# Altium schematic sheet mcu_core.SchDoc
size A4; SheetNumber: 3; SheetTotal: 12
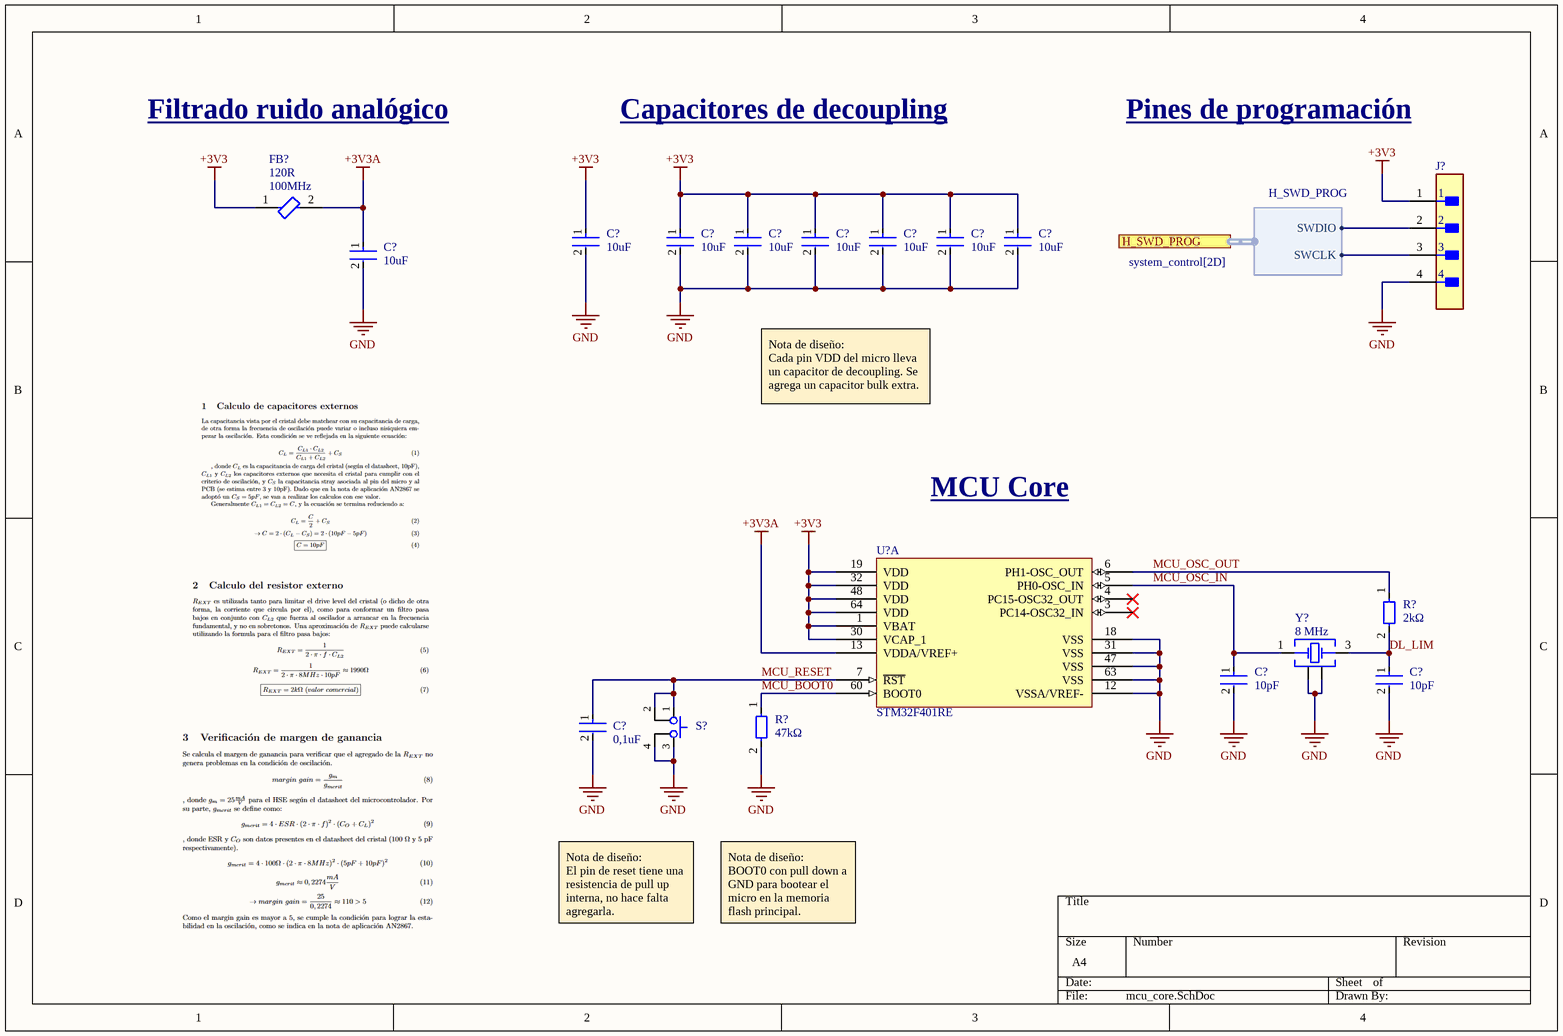
[diagram p0: mcu_core.SchDoc]

## Parts
(Parts that share a designator on the sheet are numbered #1, #2 ... from top to bottom, then left to right.)
C?#1  Capacitance: 10uF  [CAP_0805]  (hidden comment: Simbolo de capacitor genérico)
C?#2  Capacitance: 10uF  [CAP_0805]  (hidden comment: Simbolo de capacitor genérico)
C?#3  Capacitance: 10uF  [CAP_0805]  (hidden comment: Simbolo de capacitor genérico)
C?#4  Capacitance: 10uF  [CAP_0805]  (hidden comment: Simbolo de capacitor genérico)
C?#5  Capacitance: 10uF  [CAP_0805]  (hidden comment: Simbolo de capacitor genérico)
C?#6  Capacitance: 10uF  [CAP_0805]  (hidden comment: Simbolo de capacitor genérico)
C?#7  Capacitance: 10uF  [CAP_0805]  (hidden comment: Simbolo de capacitor genérico)
C?#8  Capacitance: 10uF  [CAP_0805]  (hidden comment: Simbolo de capacitor genérico)
C?#9  Capacitance: 10pF  [CAP_0805]  (hidden comment: Simbolo de capacitor genérico)
C?#10  Capacitance: 10pF  [CAP_0805]  (hidden comment: Simbolo de capacitor genérico)
C?#11  Capacitance: 0,1uF  [CAP_0805]  (hidden comment: Simbolo de capacitor genérico)
FB?  Test Frequency: 100MHz  Impedance: 120R  [FP-BLM21-0_2-t0_85-e0_5-IPC_A]  (hidden comment: BLM21BD121SN1D)
J?  HTSW-104-07-G-S  [FP-HTSW-104-07-G-S-MFG]  (value not drawn)
R?#1  value 2kΩ  [RES_0805]  (hidden comment: Simbolo de resistencia genérica)
R?#2  value 47kΩ  [RES_0805]  (hidden comment: Simbolo de resistencia genérica)
S?  Tactile push button 5,2mm x 5,2mm  [Switch Tactile 5,2mm x 5,2mm]  (value not drawn)
U?  STM32F401RE  [FP-LQFP64-5W-IPC_B]  (part A of 2)
Y?  Frequency: 8 MHz  [SMD5032-4P]  (hidden comment: Crystal SMD 4-P)

## Ports
H_SWD_PROG (harness H_SWD_PROG, see system_control[2D])

## Harnesses
H_SWD_PROG: SWDIO, SWCLK

## Nets
+3V3: C?#1.1 C?#2.1 C?#3.1 C?#4.1 C?#5.1 C?#6.1 C?#7.1 FB?.1 J?.1 U?.1(VBAT) U?.19(VDD) U?.30(VCAP_1) U?.32(VDD) U?.48(VDD) U?.64(VDD)
+3V3A: C?#8.1 FB?.2 U?.13(VDDA/VREF+)
GND: C?#1.2 C?#2.2 C?#3.2 C?#4.2 C?#5.2 C?#6.2 C?#7.2 C?#8.2 C?#9.2 C?#10.2 C?#11.2 J?.4 R?#2.2 S?.3 S?.4 U?.12(VSSA/VREF-) U?.18(VSS) U?.31(VSS) U?.47(VSS) U?.63(VSS) Y?.2(GND_&_Lid) Y?.4(GND_&_Lid)
DL_LIM: C?#10.1 R?#1.2 Y?.3(Crystal)
MCU_BOOT0: R?#2.1 U?.60(BOOT0)
MCU_OSC_IN: C?#9.1 U?.5(PH0-OSC_IN) Y?.1(Crystal)
MCU_OSC_OUT: R?#1.1 U?.6(PH1-OSC_OUT)
MCU_RESET: C?#11.1 S?.1 S?.2 U?.7(~{RST})
NetJ?_2: J?.2 ; port H_SWD_PROG.SWDIO
NetJ?_3: J?.3 ; port H_SWD_PROG.SWCLK

Not connected (* = marked no-connect by the designer): U? 3(PC14-OSC32_IN)* 4(PC15-OSC32_OUT)*

## Notes on the sheet
- Filtrado ruido analógico
- Capacitores de decoupling
- Pines de programación
- Nota de diseño:
  Cada pin VDD del micro lleva un capacitor de decoupling. Se agrega un capacitor bulk extra.
- MCU Core
- Nota de diseño:
  El pin de reset tiene una resistencia de pull up interna, no hace falta agregarla.
- Nota de diseño:
  BOOT0 con pull down a GND para bootear el micro en la memoria flash principal.

## Library data of the parts
C?#1-C?#11 = Generic C: Dielectric: X5R; Voltage Rating: 10V; Tolerance: 10%; Case Code (Imperial): 0805; Mount: Surface Mount; Depth: 1.25mm; Length: 2mm; Lead Free: Lead Free; Packaging: Tape and Reel; Width: 0.049inch; Package Quantity: 1; Height: 1.25mm; Case/Package: 0805; Thickness: 0.053inch; Max Operating Temperature: 85°C; Case Code (Metric): 2012; Contact Plating: Tin; Min Operating Temperature: -55°C; Radiation Hardening: No; Voltage Rating (DC): 10V
FB? = CMP-0686-00664-3: Chip Ferrite Bead, 0805, 120Ω @ 100MHz, 0.25Ω, 25%, 350mA; DC Resistance-Max: 250mR; Number of Lines: 1; Shielding: Unshielded; Current Rating: 200mA; Material: Steel; Max Operating Temperature: 125°C; Tolerance: 25%; DC Resistance (DCR): 250mR; REACH SVHC: No SVHC; Packaging: Tape and Reel; Package Quantity: 1; Depth: 1.25mm; Max DC Current: 200mA; Termination: SMD/SMT; Number of Circuits: 1; Lead Free: Lead Free; Case Code (Imperial): 0805; Height: 0.85mm; Number of Pins: 2; Series: BLM21B; Length: 2mm; Max Current Rating: 350mA; Case Code (Metric): 2012; Width: 1.25mm; Core Material: Ferrite; Min Operating Temperature: -55°C; Frequency: 100MHz; Case/Package: 0805
J? = CMP-02766-001776-1: CONN HEADER VERT 4POS 2.54MM; Gender: Male; Number of Contacts: 4; Packaging: Bulk; RoHS Compliant: Yes; Number of Rows: 1; Mount: Through Hole; Contact Material: Bronze; Series: HTSW; Radiation Hardening: No; Pitch: 2.54mm; Reach SVHC Compliant: Yes; Contact Plating: Gold; Termination: Through Hole
R?#1 R?#2 = Generic R
S? = Tactile push button 5,2mm x 5,2mm: Switch Tactile SPST-NO 5,2mm x 5,2mm
Y? = Crystal SMD 4-P: Cristal SMD 4-P genérico; Manufacturer part: SX5B8.000F1020F30; Manufacturer: Shenzhen SCTF Elec; CL: 10 pF; ESR: 100 Ω; Datasheet: https://jlcpcb.com/api/file/downloadByFileSystemAccessId/8590208237112238080; Package: SMD5032-4P